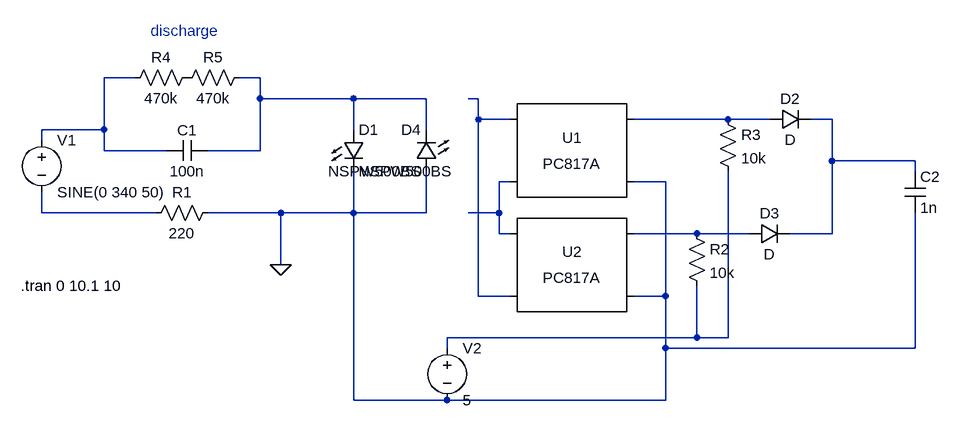
[diagram p0: schematic led_mains 2.asc]
led_mains 2.asc, the LTspice schematic file:
Version 4
SHEET 1 1624 944
WIRE 192 272 144 272
WIRE 384 272 352 272
WIRE 384 304 384 272
WIRE 528 304 384 304
WIRE 640 304 528 304
WIRE 720 304 704 304
WIRE 720 336 720 304
WIRE 768 336 720 336
WIRE 1104 336 960 336
WIRE 1168 336 1104 336
WIRE 1264 336 1232 336
WIRE 144 352 144 272
WIRE 144 352 48 352
WIRE 528 352 528 304
WIRE 640 352 640 304
WIRE 48 368 48 352
WIRE 144 384 144 352
WIRE 240 384 144 384
WIRE 384 384 384 304
WIRE 384 384 304 384
WIRE 1264 400 1264 336
WIRE 1392 400 1264 400
WIRE 1392 416 1392 400
WIRE 768 432 752 432
WIRE 1008 432 960 432
WIRE 48 480 48 448
WIRE 224 480 48 480
WIRE 416 480 304 480
WIRE 528 480 528 416
WIRE 528 480 416 480
WIRE 640 480 640 416
WIRE 640 480 528 480
WIRE 752 480 752 432
WIRE 752 480 704 480
WIRE 752 512 752 480
WIRE 768 512 752 512
WIRE 1056 512 960 512
WIRE 1136 512 1056 512
WIRE 1264 512 1264 400
WIRE 1264 512 1200 512
WIRE 416 560 416 480
WIRE 720 608 720 336
WIRE 768 608 720 608
WIRE 1008 608 1008 432
WIRE 1008 608 960 608
WIRE 1056 672 1056 592
WIRE 1056 672 672 672
WIRE 1104 672 1104 416
WIRE 1104 672 1056 672
WIRE 672 688 672 672
WIRE 1008 688 1008 608
WIRE 1392 688 1392 480
WIRE 1392 688 1008 688
WIRE 528 768 528 480
WIRE 672 768 528 768
WIRE 1008 768 1008 688
WIRE 1008 768 672 768
FLAG 416 560 0
SYMBOL voltage 48 352 R0
SYMATTR InstName V1
SYMATTR Value SINE(0 340 50)
SYMBOL cap 304 368 R90
WINDOW 0 0 32 VBottom 2
WINDOW 3 32 32 VTop 2
SYMATTR InstName C1
SYMATTR Value 100n
SYMBOL res 320 464 R90
WINDOW 0 0 56 VBottom 2
WINDOW 3 32 56 VTop 2
SYMATTR InstName R1
SYMATTR Value 220
SYMBOL voltage 672 672 R0
SYMATTR InstName V2
SYMATTR Value 5
SYMBOL res 1088 320 R0
SYMATTR InstName R3
SYMATTR Value 10k
SYMBOL cap 1376 416 R0
SYMATTR InstName C2
SYMATTR Value 1n
SYMBOL Optos/PC817A 864 384 R0
SYMATTR InstName U1
SYMBOL Optos/PC817A 864 560 R0
SYMATTR InstName U2
SYMBOL res 1040 496 R0
SYMATTR InstName R2
SYMATTR Value 10k
SYMBOL diode 1168 352 R270
WINDOW 0 32 32 VTop 2
WINDOW 3 0 32 VBottom 2
SYMATTR InstName D2
SYMBOL diode 1136 528 R270
WINDOW 0 32 32 VTop 2
WINDOW 3 0 32 VBottom 2
SYMATTR InstName D3
SYMBOL res 288 256 R90
WINDOW 0 0 56 VBottom 2
WINDOW 3 32 56 VTop 2
SYMATTR InstName R4
SYMATTR Value 470k
SYMBOL res 368 256 R90
WINDOW 0 0 56 VBottom 2
WINDOW 3 32 56 VTop 2
SYMATTR InstName R5
SYMATTR Value 470k
SYMBOL LED 512 352 R0
SYMATTR InstName D1
SYMATTR Value NSPW500BS
SYMBOL LED 656 416 R180
WINDOW 0 24 64 Left 2
WINDOW 3 24 0 Left 2
SYMATTR InstName D4
SYMATTR Value NSPW500BS
TEXT 16 592 Left 2 !.tran 0 10.1 10
TEXT 216 200 Left 2 ;discharge

The netlist it stands for:
* led_mains 2.asc
V1 N001 N007 SINE(0 340 50)
C1 N002 N001 100n
R1 0 N007 220
V2 N009 0 5
R3 N004 N009 10k
C2 N005 0 1n
XU1 N003 N006 N004 0 PC817 Igain=1m
XU2 N006 N003 N008 0 PC817 Igain=1m
R2 N008 N009 10k
D2 N004 N005 D
D3 N008 N005 D
R4 P001 N001 470k
R5 N002 P001 470k
D1 N002 0 NSPW500BS
D4 0 N002 NSPW500BS
.model D D
.lib standard.dio
.tran 0 10.1 10
* discharge
.lib PC817.sub
.backanno
.end